# Altium schematic sheet Joiners.SchDoc: FPGA Stratix 672 SmartPack Example
size A; Author: BJ; Organization: Altium Limited; Address1: L3, 12a Rodborough Rd; Address2: Frenchs Forest; Address3: NSW; Address4: Australia 2086; DocumentNumber: 2; Revision: 0; SheetNumber: 2; SheetTotal: 2
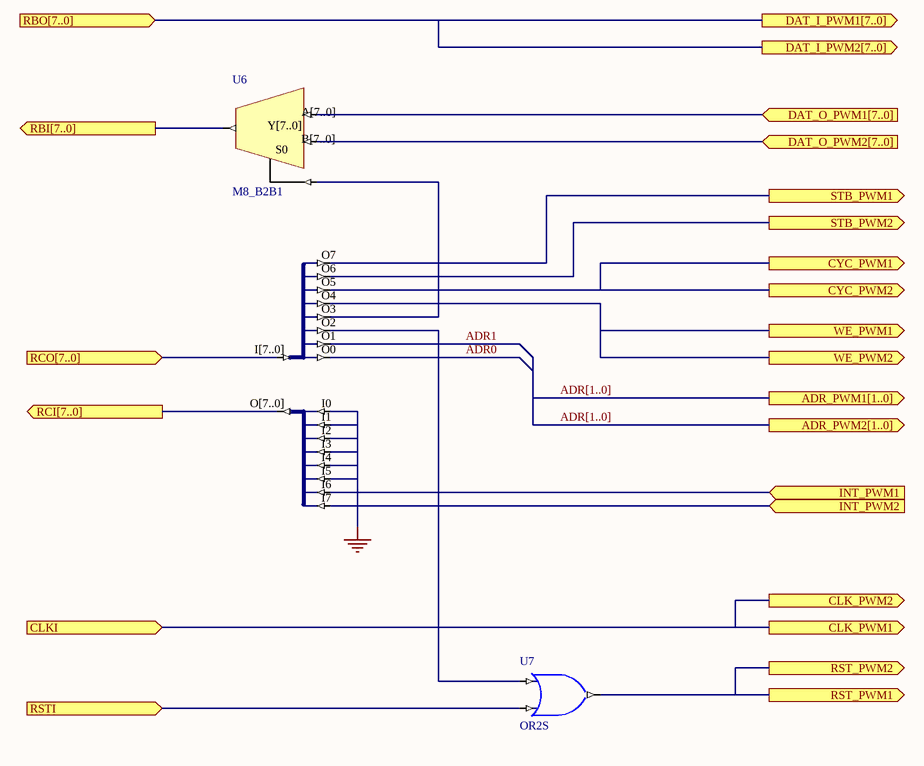
[diagram p0: Joiners.SchDoc]

## Parts
J1  J8B_8S  (value not drawn)
J2  J8S_8B  (value not drawn)
U6  M8_B2B1
U7  OR2S

## Ports
ADR_PWM1[1..0] (out), ADR_PWM2[1..0] (out), CLK_PWM1 (out), CLK_PWM2 (out), CLKI (in), CYC_PWM1 (out), CYC_PWM2 (out), DAT_I_PWM1[7..0] (out), DAT_I_PWM2[7..0] (out), DAT_O_PWM1[7..0] (in), DAT_O_PWM2[7..0] (in), INT_PWM1 (in), INT_PWM2 (in), RBI[7..0] (out), RBO[7..0] (in), RCI[7..0] (out), RCO[7..0] (in), RST_PWM1 (out), RST_PWM2 (out), RSTI (in), STB_PWM1 (out), STB_PWM2 (out), WE_PWM1 (out), WE_PWM2 (out)

## Nets
GND: J2.I0 J2.I1 J2.I2 J2.I3 J2.I4 J2.I5
ADR0: J1.O0
ADR1: J1.O1
CLK_PWM1: port CLK_PWM1, port CLKI, port CLK_PWM2
CYC_PWM1: J1.O5 ; port CYC_PWM1, port CYC_PWM2
DAT_O_PWM1[7..0]: U6.A[7..0] ; port DAT_O_PWM1[7..0]
DAT_O_PWM2[7..0]: U6.B[7..0] ; port DAT_O_PWM2[7..0]
INT_PWM1: J2.I6 ; port INT_PWM1
INT_PWM2: J2.I7 ; port INT_PWM2
RBI[7..0]: U6.Y[7..0] ; port RBI[7..0]
RCI[7..0]: J2.O[7..0] ; port RCI[7..0]
RCO[7..0]: J1.I[7..0] ; port RCO[7..0]
RST_PWM1: U7.O ; port RST_PWM1, port RST_PWM2
RSTI: U7.I1 ; port RSTI
STB_PWM1: J1.O7 ; port STB_PWM1
STB_PWM2: J1.O6 ; port STB_PWM2
WE_PWM1: J1.O4 ; port WE_PWM1, port WE_PWM2
NetJ1_O2: J1.O2 U7.I0
NetJ1_O3: J1.O3 U6.S0

## Buses and harness runs
bus ADR[1..0] = port ADR_PWM1[1..0] = port ADR_PWM2[1..0]
bus port DAT_I_PWM1[7..0] = port DAT_I_PWM2[7..0] = port RBO[7..0]

## Notes on the sheet
- Title
- Size:
- Date:
- A
- Number:
- Time:
- Revision:
- Sheet
- of
- File:

## Library data of the parts
J1 = J8B_8S: 8-Bit input bus to 8 single pin outputs; FunctionalClass: Bus Joiner; PortSize: 8; ArchiveName: GENERIC; VHDLIB_SIM: GENERIC_LIB; Published: 29-Jan-2004; Publisher: Altium Limited; LastRevisionNo: 1.00.00; HelpURL: CR0118 FPGA Generic Library Guide.pdf#page=303; ComponentLink1URL: CR0126 FPGA Bus Joiner Resource Usage.pdf#page=27; ComponentLink1Description: Core &Resource Usage
J2 = J8S_8B: 8 Single pin inputs to single 8-Bit output bus; FunctionalClass: Bus Joiner; PortSize: 8; ArchiveName: GENERIC; VHDLIB_SIM: GENERIC_LIB; Published: 29-Jan-2004; Publisher: Altium Limited; LastRevisionNo: 1.00.00; HelpURL: CR0118 FPGA Generic Library Guide.pdf#page=305; ComponentLink1URL: CR0126 FPGA Bus Joiner Resource Usage.pdf#page=28; ComponentLink1Description: Core &Resource Usage
U6 = M8_B2B1: 2x8-Bit Bus to 1x8-Bit Bus Multiplexer; SubClass: BnB1; PortSize: 8; PortStyle: Bus Version; ArchiveName: GENERIC; VHDLIB_SIM: GENERIC_LIB; Published: 29-Jan-2004; Publisher: Altium Limited; LastRevisionNo: 1.00.00; HelpURL: CR0118 FPGA Generic Library Guide.pdf#page=358; ComponentLink1URL: CR0137 FPGA Multiplexer Resource Usage.pdf#page=302; ComponentLink1Description: Core &Resource Usage; FunctionalClass: Multiplexer
U7 = OR2S: 2-Input OR Gate, Single Pin Version; XilinxEquivalent: OR2; FunctionalClass: Logic Primitive; PortSize: 2; ArchiveName: GENERIC; VHDLIB_SIM: GENERIC_LIB; Published: 29-Jan-2004; Publisher: Altium Limited; LastRevisionNo: 1.00.00; HelpURL: CR0118 FPGA Generic Library Guide.pdf#page=404; ComponentLink1URL: CR0136 FPGA Logic Primitive Resource Usage.pdf#page=190; ComponentLink1Description: Core &Resource Usage; SubClass: OR; PortStyle: Single Pin Version